# Altium schematic sheet [3] TopLevel.SchDoc: =DocumentName
size A3; Organization: ORGANIZATION; Address1: R. Aprígio Veloso, 882, Universitário; Address2: Campina Grande - PB; Address3: 58429-900; DocumentNumber: 3; Revision: -; SheetNumber: 3; SheetTotal: 8; ENG_DATE: --/--/--; DSN_DATE: --/--/--; CHK_DATE: --/--/--; SCH_SCALE: 1:1
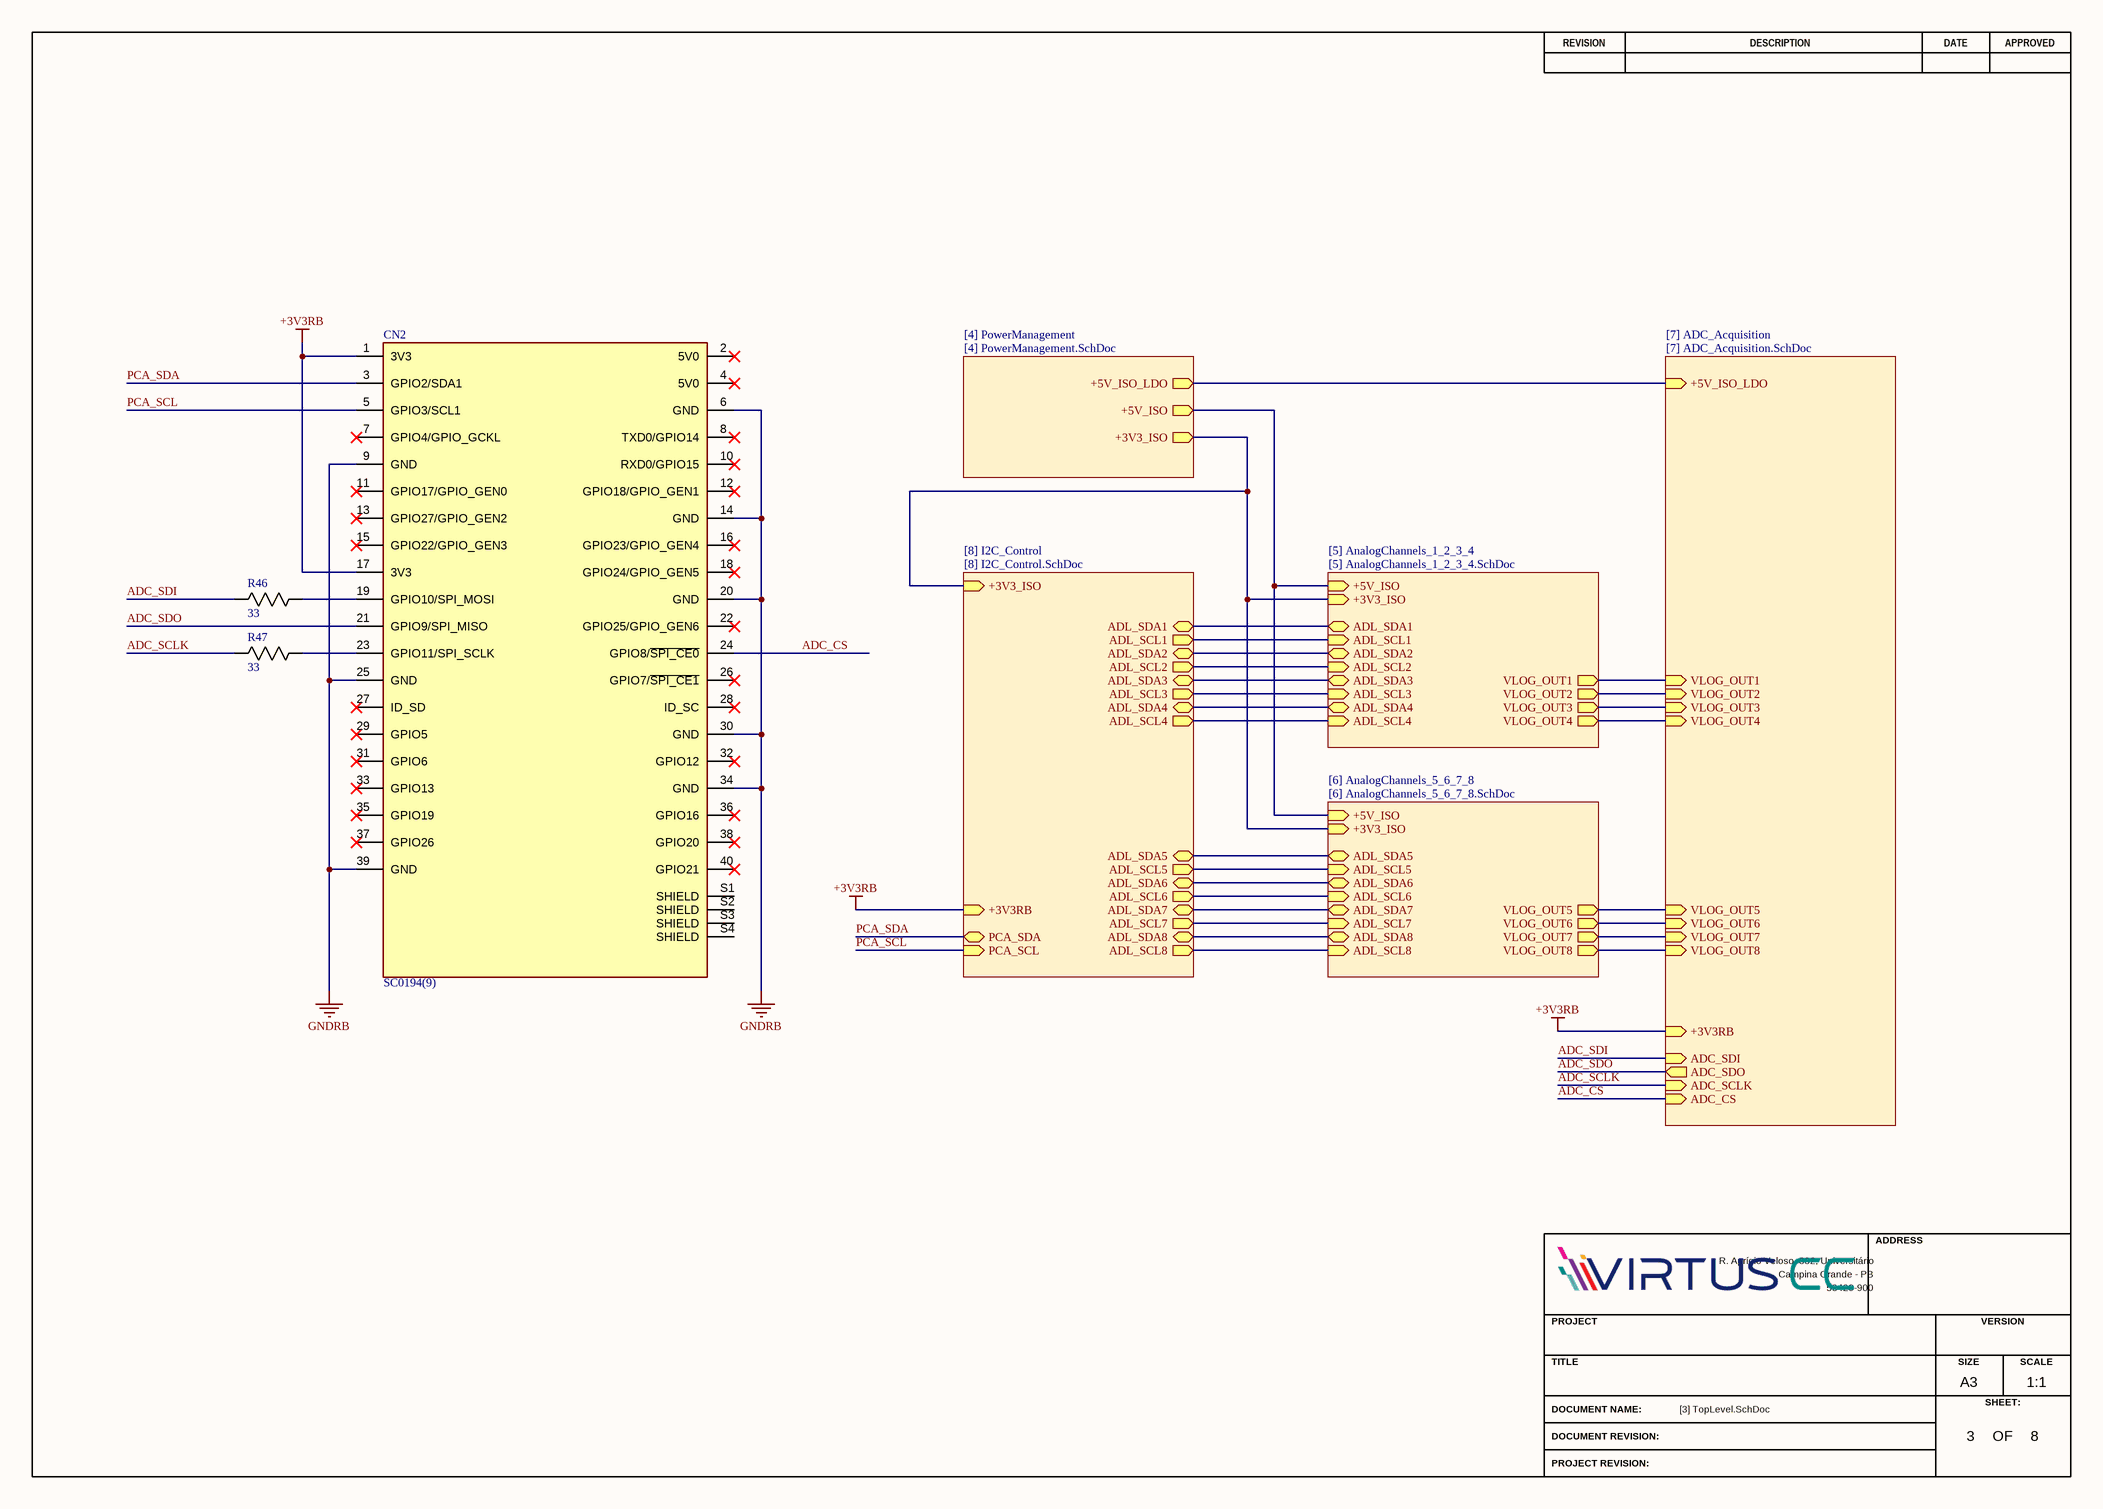
[diagram p0: [3] TopLevel.SchDoc]

## Parts
CN2  SC0194(9)  [RPI_SHIELD_CONNECTOR]
R46  value 33  [RESC1005X40N]  (hidden comment: RC0402FR-0733RL)
R47  value 33  [RESC1005X40N]  (hidden comment: RC0402FR-0733RL)

## Sub-sheets
[4] PowerManagement = [4] PowerManagement.SchDoc: +5V_ISO_LDO (out), +5V_ISO (out), +3V3_ISO (out)
[5] AnalogChannels_1_2_3_4 = [5] AnalogChannels_1_2_3_4.SchDoc: VLOG_OUT3 (out), ADL_SCL3 (in), ADL_SCL2 (in), VLOG_OUT1 (out), +5V_ISO (in), ADL_SCL4 (in), VLOG_OUT2 (out), ADL_SDA3 (bidir), ADL_SDA2 (bidir), VLOG_OUT4 (out), ADL_SCL1 (in), ADL_SDA1 (bidir), ADL_SDA4 (bidir), +3V3_ISO (in)
[6] AnalogChannels_5_6_7_8 = [6] AnalogChannels_5_6_7_8.SchDoc: +5V_ISO (in), ADL_SDA5 (bidir), ADL_SCL8 (in), ADL_SCL6 (in), ADL_SDA6 (bidir), ADL_SDA7 (bidir), ADL_SDA8 (bidir), VLOG_OUT6 (out), ADL_SCL7 (in), ADL_SCL5 (in), VLOG_OUT5 (out), VLOG_OUT7 (out), VLOG_OUT8 (out), +3V3_ISO (in)
[7] ADC_Acquisition = [7] ADC_Acquisition.SchDoc: VLOG_OUT1 (in), VLOG_OUT7 (in), VLOG_OUT6 (in), VLOG_OUT2 (in), +5V_ISO_LDO (in), VLOG_OUT8 (in), VLOG_OUT5 (in), VLOG_OUT3 (in), VLOG_OUT4 (in), ADC_SDO (out), +3V3RB (in), ADC_CS (in), ADC_SDI (in), ADC_SCLK (in)
[8] I2C_Control = [8] I2C_Control.SchDoc: ADL_SDA5 (bidir), ADL_SCL3 (out), ADL_SCL1 (out), ADL_SDA4 (bidir), ADL_SCL6 (out), ADL_SDA8 (bidir), ADL_SCL8 (out), ADL_SCL4 (out), ADL_SDA7 (bidir), ADL_SDA2 (bidir), ADL_SDA1 (bidir), ADL_SCL2 (out), ADL_SDA3 (bidir), ADL_SDA6 (bidir), ADL_SCL5 (out), ADL_SCL7 (out), PCA_SDA (bidir), PCA_SCL (in), +3V3RB (in), +3V3_ISO (in)

## Nets
+3V3RB: CN2.1(3V3) CN2.17(3V3) ; sheet [8] I2C_Control/+3V3RB, sheet [7] ADC_Acquisition/+3V3RB
GNDRB: CN2.6(GND) CN2.9(GND) CN2.14(GND) CN2.20(GND) CN2.25(GND) CN2.30(GND) CN2.34(GND) CN2.39(GND)
ADC_CS: CN2.24(GPIO8/~{SPI_CE0}) ; sheet [7] ADC_Acquisition/ADC_CS
ADC_SCLK: R47.2 ; sheet [7] ADC_Acquisition/ADC_SCLK
ADC_SDI: R46.2 ; sheet [7] ADC_Acquisition/ADC_SDI
ADC_SDO: CN2.21(GPIO9/SPI_MISO) ; sheet [7] ADC_Acquisition/ADC_SDO
PCA_SCL: CN2.5(GPIO3/SCL1) ; sheet [8] I2C_Control/PCA_SCL
PCA_SDA: CN2.3(GPIO2/SDA1) ; sheet [8] I2C_Control/PCA_SDA
NetCN2_19: CN2.19(GPIO10/SPI_MOSI) R46.1
NetCN2_23: CN2.23(GPIO11/SPI_SCLK) R47.1
(unnamed): sheet [5] AnalogChannels_1_2_3_4/VLOG_OUT3, sheet [7] ADC_Acquisition/VLOG_OUT3
(unnamed): sheet [5] AnalogChannels_1_2_3_4/ADL_SCL3, sheet [8] I2C_Control/ADL_SCL3
(unnamed): sheet [5] AnalogChannels_1_2_3_4/ADL_SCL2, sheet [8] I2C_Control/ADL_SCL2
(unnamed): sheet [5] AnalogChannels_1_2_3_4/VLOG_OUT1, sheet [7] ADC_Acquisition/VLOG_OUT1
(unnamed): sheet [5] AnalogChannels_1_2_3_4/+5V_ISO, sheet [6] AnalogChannels_5_6_7_8/+5V_ISO, sheet [4] PowerManagement/+5V_ISO
(unnamed): sheet [5] AnalogChannels_1_2_3_4/ADL_SCL4, sheet [8] I2C_Control/ADL_SCL4
(unnamed): sheet [5] AnalogChannels_1_2_3_4/VLOG_OUT2, sheet [7] ADC_Acquisition/VLOG_OUT2
(unnamed): sheet [5] AnalogChannels_1_2_3_4/ADL_SDA3, sheet [8] I2C_Control/ADL_SDA3
(unnamed): sheet [5] AnalogChannels_1_2_3_4/ADL_SDA2, sheet [8] I2C_Control/ADL_SDA2
(unnamed): sheet [5] AnalogChannels_1_2_3_4/VLOG_OUT4, sheet [7] ADC_Acquisition/VLOG_OUT4
(unnamed): sheet [5] AnalogChannels_1_2_3_4/ADL_SCL1, sheet [8] I2C_Control/ADL_SCL1
(unnamed): sheet [5] AnalogChannels_1_2_3_4/ADL_SDA1, sheet [8] I2C_Control/ADL_SDA1
(unnamed): sheet [5] AnalogChannels_1_2_3_4/ADL_SDA4, sheet [8] I2C_Control/ADL_SDA4
(unnamed): sheet [5] AnalogChannels_1_2_3_4/+3V3_ISO, sheet [6] AnalogChannels_5_6_7_8/+3V3_ISO, sheet [4] PowerManagement/+3V3_ISO, sheet [8] I2C_Control/+3V3_ISO
(unnamed): sheet [6] AnalogChannels_5_6_7_8/ADL_SDA5, sheet [8] I2C_Control/ADL_SDA5
(unnamed): sheet [6] AnalogChannels_5_6_7_8/ADL_SCL8, sheet [8] I2C_Control/ADL_SCL8
(unnamed): sheet [6] AnalogChannels_5_6_7_8/ADL_SCL6, sheet [8] I2C_Control/ADL_SCL6
(unnamed): sheet [6] AnalogChannels_5_6_7_8/ADL_SDA6, sheet [8] I2C_Control/ADL_SDA6
(unnamed): sheet [6] AnalogChannels_5_6_7_8/ADL_SDA7, sheet [8] I2C_Control/ADL_SDA7
(unnamed): sheet [6] AnalogChannels_5_6_7_8/ADL_SDA8, sheet [8] I2C_Control/ADL_SDA8
(unnamed): sheet [6] AnalogChannels_5_6_7_8/VLOG_OUT6, sheet [7] ADC_Acquisition/VLOG_OUT6
(unnamed): sheet [6] AnalogChannels_5_6_7_8/ADL_SCL7, sheet [8] I2C_Control/ADL_SCL7
(unnamed): sheet [6] AnalogChannels_5_6_7_8/ADL_SCL5, sheet [8] I2C_Control/ADL_SCL5
(unnamed): sheet [6] AnalogChannels_5_6_7_8/VLOG_OUT5, sheet [7] ADC_Acquisition/VLOG_OUT5
(unnamed): sheet [6] AnalogChannels_5_6_7_8/VLOG_OUT7, sheet [7] ADC_Acquisition/VLOG_OUT7
(unnamed): sheet [6] AnalogChannels_5_6_7_8/VLOG_OUT8, sheet [7] ADC_Acquisition/VLOG_OUT8
(unnamed): sheet [4] PowerManagement/+5V_ISO_LDO, sheet [7] ADC_Acquisition/+5V_ISO_LDO

Not connected (* = marked no-connect by the designer): CN2 2(5V0)* 4(5V0)* 7(GPIO4/GPIO_GCKL)* 8(TXD0/GPIO14)* 10(RXD0/GPIO15)* 11(GPIO17/GPIO_GEN0)* 12(GPIO18/GPIO_GEN1)* 13(GPIO27/GPIO_GEN2)* 15(GPIO22/GPIO_GEN3)* 16(GPIO23/GPIO_GEN4)* 18(GPIO24/GPIO_GEN5)* 22(GPIO25/GPIO_GEN6)* 26(GPIO7/~{SPI_CE1})* 27(ID_SD)* 28(ID_SC)* 29(GPIO5)* 31(GPIO6)* 32(GPIO12)* 33(GPIO13)* 35(GPIO19)* 36(GPIO16)* 37(GPIO26)* 38(GPIO20)* 40(GPIO21)* S1(SHIELD) S2(SHIELD) S3(SHIELD) S4(SHIELD)

## Notes on the sheet
- REVISION
- DESCRIPTION
- DATE
- APPROVED
- ADDRESS
- PROJECT
- VERSION
- TITLE
- A3
- SIZE
- SCALE
- DOCUMENT NAME:
- DOCUMENT REVISION:
- OF
- SHEET:
- PROJECT REVISION:

## Library data of the parts
CN2 = SC0194(9): The Raspberry Pi 4 Model B SC0194(9) single board computer features a Broadcom BCM2711 ARM Cortex-A72 quad-core processor operating at 1.5GHz, making it a powerful choice for embedded computing applications. Equipped with 4GB of RAM and a variety of conne; SnapEDA_Link: https://www.snapeda.com/parts/SC0194(9)/Raspberry+Pi/view-part/?ref=snap; Package: None; Value: *; MF: Raspberry Pi; MP: SC0194(9); Check_prices: https://www.snapeda.com/parts/SC0194(9)/Raspberry+Pi/view-part/?ref=eda
R46 R47 = RC0402FR-0733RL: 33 Ohms ±1% 0.063W, 1/16W Chip Resistor 0402 (1005 Metric) Moisture Resistant Thick Film; Manufacturer_Name: Yageo; Copyright: Copyright (C) 2025 Ultra Librarian. All rights reserved.; Manufacturer_Part_Number: RC0402FR-0733RL; Supplier 1: DigiKey; Supplier Part Number 1: 311-33.0LRCT-ND; Datasheet Link: https://yageogroup.com/content/datasheet/asset/file/PYU-RC_GROUP_51_ROHS_L